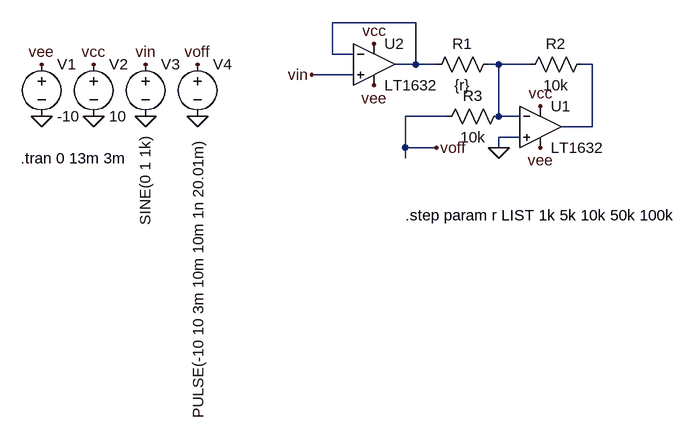
[diagram p0: schematic adc-in.asc]
adc-in.asc, the LTspice schematic file:
Version 4
SHEET 1 880 680
WIRE 32 0 -96 0
WIRE -96 48 -96 0
WIRE -64 48 -96 48
WIRE 32 64 32 0
WIRE 32 64 0 64
WIRE 64 64 32 64
WIRE 160 64 144 64
WIRE 208 64 160 64
WIRE 304 64 288 64
WIRE -64 80 -128 80
WIRE 80 144 16 144
WIRE 160 144 160 64
WIRE 192 144 160 144
WIRE 304 160 304 64
WIRE 304 160 256 160
WIRE 192 176 160 176
WIRE 16 192 16 144
WIRE 64 192 16 192
WIRE 160 192 160 176
WIRE 16 208 16 192
FLAG 224 192 vee
FLAG 224 128 vcc
FLAG -464 144 0
FLAG -544 144 0
FLAG -544 64 vee
FLAG -464 64 vcc
FLAG -384 144 0
FLAG -384 64 vin
FLAG -128 80 vin
FLAG -304 144 0
FLAG 160 192 0
FLAG -304 64 voff
FLAG 64 192 voff
FLAG -32 32 vcc
FLAG -32 96 vee
SYMBOL Opamps\\LT1632 224 96 R0
SYMATTR InstName U1
SYMBOL voltage -544 48 R0
WINDOW 123 0 0 Left 2
WINDOW 39 0 0 Left 2
SYMATTR InstName V1
SYMATTR Value -10
SYMBOL voltage -464 48 R0
WINDOW 123 0 0 Left 2
WINDOW 39 0 0 Left 2
SYMATTR InstName V2
SYMATTR Value 10
SYMBOL res 160 48 R90
WINDOW 0 0 56 VBottom 2
WINDOW 3 32 56 VTop 2
SYMATTR InstName R1
SYMATTR Value {r}
SYMBOL res 304 48 R90
WINDOW 0 0 56 VBottom 2
WINDOW 3 32 56 VTop 2
SYMATTR InstName R2
SYMATTR Value 10k
SYMBOL voltage -384 48 R0
WINDOW 123 0 0 Left 2
WINDOW 39 0 0 Left 2
WINDOW 3 0 126 VRight 2
SYMATTR InstName V3
SYMATTR Value SINE(0 1 1k)
SYMBOL voltage -304 48 R0
WINDOW 123 0 0 Left 2
WINDOW 39 0 0 Left 2
WINDOW 3 1 127 VRight 2
SYMATTR InstName V4
SYMATTR Value PULSE(-10 10 3m 10m 10m 1n 20.01m)
SYMBOL res 176 128 R90
WINDOW 0 0 56 VBottom 2
WINDOW 3 32 56 VTop 2
SYMATTR InstName R3
SYMATTR Value 10k
SYMBOL Opamps\\LT1632 -32 0 R0
SYMATTR InstName U2
TEXT -576 208 Left 2 !.tran 0 13m 3m
TEXT 16 296 Left 2 !.step param r LIST 1k 5k 10k 50k 100k

The netlist it stands for:
* adc-in.asc
XU1 0 N002 vcc vee N003 LT1632  ; pins In+ In- V+ V- OUT
V1 vee 0 -10
V2 vcc 0 10
R1 N002 N001 {r}
R2 N003 N002 10k
V3 vin 0 SINE(0 1 1k)
V4 voff 0 PULSE(-10 10 3m 10m 10m 1n 20.01m)
R3 N002 voff 10k
XU2 vin N001 vcc vee N001 LT1632  ; pins In+ In- V+ V- OUT
.tran 0 13m 3m
.step param r LIST 1k 5k 10k 50k 100k
.lib LTC.lib
.backanno
.end